# EAGLE design signal_inverter (EAGLE 9.6.2)
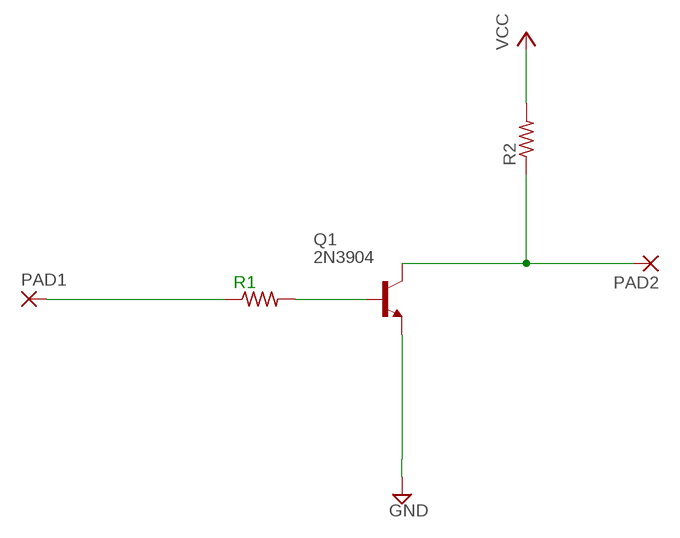
[diagram p0: schematic, sheet 1]

## Parts
PAD1  2,15/1,0  [2,15/1,0]
PAD2  2,15/1,0  [2,15/1,0]
Q1  2N3904  [TO92]
R1  R-US_0204/7  [0204/7]
R2  R-US_0204/7  [0204/7]

## Nets
GND: Q1.3(E)
N$1: Q1.2(B) R1.2
N$2: PAD2.1(P) Q1.1(C) R2.1
N$3: PAD1.1(P) R1.1
VCC: R2.2

## Library data of the parts
PAD1 PAD2 = wirepad:2,15/1,0: THROUGH-HOLE PAD
Q1 = transistor-npn:2N3904: NPN Transistor
R1 R2 = adafruit:R-US_: RESISTOR, American symbol

## Board
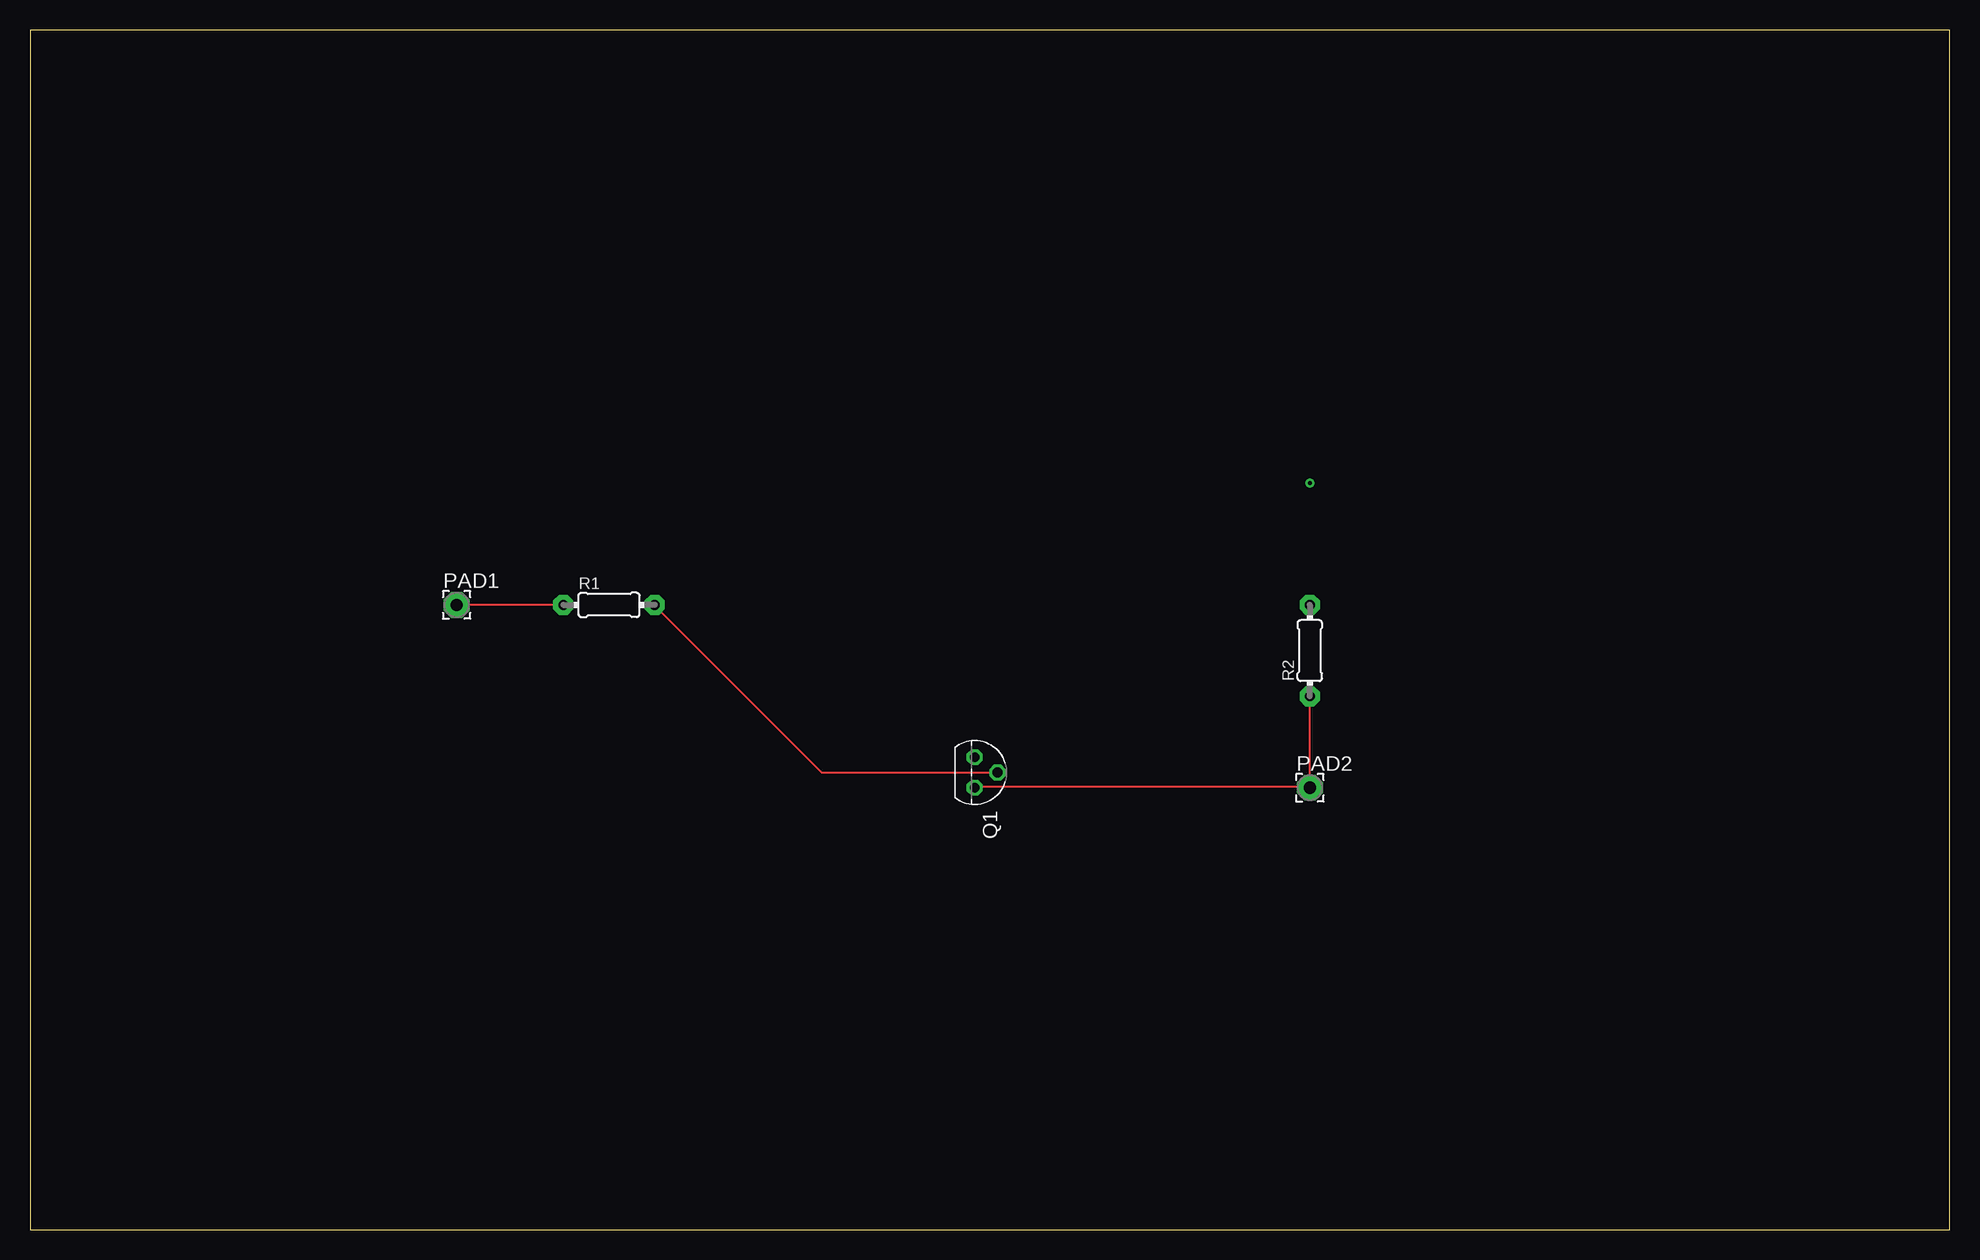
[diagram p1: board, top side]

Size 160 x 100 mm. Coordinates in mm from the lower left corner, seen from the top.
Outline: 0,0 160,0 160,100 0,100 0,0
Copper layers (1*16): Top 0.035mm / dielectric 1.5mm / Bottom 0.035mm
Design rules "default": minimum track width 6mil, minimum drill 0.35mm, track to track 6mil, track to pad 6mil, pad to pad 6mil, via to via 6mil, smd to smd 6mil, copper to edge 40mil, drill to drill 6mil, minimum pad ring 10mil, minimum via ring 8mil, stop-mask expansion 4mil, vias tented up to drill 0mil, thermal gap 10mil

### Footprints (pad centres in the part's own frame; a part is rotated, then mirrored left to right if it is on the bottom)
2,15/1,0 = drill 1.016 pad 2.159 octagon: 1 0,0
TO92 = drill 0.813 octagon: 1 1.27,0; 2 0,1.905; 3 -1.27,0
0204/7 = drill 0.813 pad 1.676 octagon: 1 -3.81,0; 2 3.81,0

### Placement (x,y rotation side)
PAD1  35.56,52.07 0 top
PAD2  106.68,36.83 0 top
Q1  78.74,38.1 270 top
R1  48.26,52.07 0 top
R2  106.68,48.26 90 top

### Tracks (layer width: path | path; a pad name or v marks a point on that pad's centre or on a via)
N$1
  Top 0.152: Q1.2 65.99,38.1 52.12,51.97 R1.2
N$2
  Top 0.152: 106.68,36.88 78.79,36.88 Q1.1 | 106.68,36.88 R2.1 | 106.68,36.88 PAD2.1
N$3
  Top 0.152: R1.1 44.35,52.12 35.66,52.12 PAD1.1
N$4  (via drill 0.35)
  other vias: 106.68,62.23